# Altium schematic sheet RAM & FLASH.SchDoc
size A
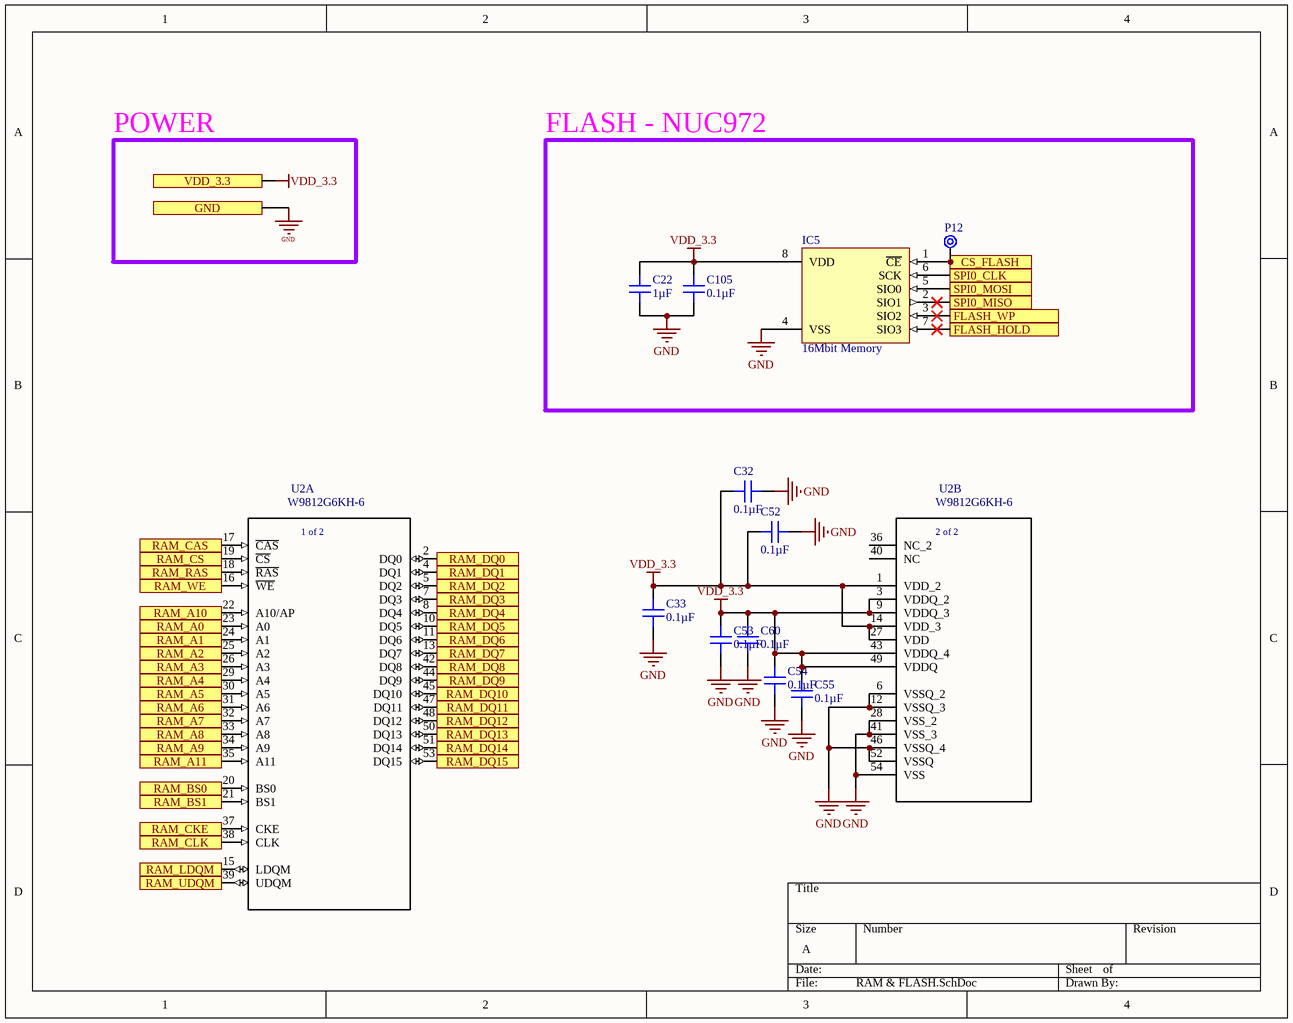
[diagram p0: RAM & FLASH.SchDoc]

## Parts
C22  1µF  [CAP 0603_1608]
C32  0.1µF  [CAP 0603_1608 RF]
C33  0.1µF  [CAP 0603_1608 RF]
C52  0.1µF  [CAP 0603_1608 RF]
C53  0.1µF  [CAP 0603_1608 RF]
C54  0.1µF  [CAP 0603_1608 RF]
C55  0.1µF  [CAP 0603_1608 RF]
C60  0.1µF  [CAP 0603_1608 RF]
C105  0.1µF  [CAP 0603_1608 RF]
IC5  16Mbit Memory  [MICROCHIP SOIC-8 150mil Wide]
P12  1 Pin  [1PINTHRU]  (value not drawn)
U2  W9812G6KH-6  [*WIN_TSOP-54_WIN]  (parts A,B of 2)

## Blocks framed on the sheet
FLASH - NUC972: C22 C105 IC5 P12

## Ports
CS_FLASH, FLASH_HOLD, FLASH_WP, GND, RAM_A0, RAM_A1, RAM_A2, RAM_A3, RAM_A4, RAM_A5, RAM_A6, RAM_A7, RAM_A8, RAM_A9, RAM_A10, RAM_A11, RAM_BS0, RAM_BS1, RAM_CAS, RAM_CKE, RAM_CLK, RAM_CS, RAM_DQ0, RAM_DQ1, RAM_DQ2, RAM_DQ3, RAM_DQ4, RAM_DQ5, RAM_DQ6, RAM_DQ7, RAM_DQ8, RAM_DQ9, RAM_DQ10, RAM_DQ11, RAM_DQ12, RAM_DQ13, RAM_DQ14, RAM_DQ15, RAM_LDQM, RAM_RAS, RAM_UDQM, RAM_WE, SPI0_CLK, SPI0_MISO, SPI0_MOSI, VDD_3.3

## Nets
GND: C22.1 C32.2 C33.2 C52.2 C53.2 C54.2 C55.2 C60.2 C105.2 IC5.4(VSS) U2.6(VSSQ_2) U2.12(VSSQ_3) U2.28(VSS_2) U2.41(VSS_3) U2.46(VSSQ_4) U2.52(VSSQ) U2.54(VSS) ; port GND
VDD_3.3: C22.2 C32.1 C33.1 C52.1 C53.1 C54.1 C55.1 C60.1 C105.1 IC5.8(VDD) U2.1(VDD_2) U2.3(VDDQ_2) U2.9(VDDQ_3) U2.14(VDD_3) U2.27(VDD) U2.43(VDDQ_4) U2.49(VDDQ) ; port VDD_3.3
CS_FLASH: IC5.1(~{CE}) P12.1(PAD) ; port CS_FLASH
FLASH_HOLD: IC5.7(SIO3) ; port FLASH_HOLD
FLASH_WP: IC5.3(SIO2) ; port FLASH_WP
RAM_A0: U2.23(A0) ; port RAM_A0
RAM_A1: U2.24(A1) ; port RAM_A1
RAM_A2: U2.25(A2) ; port RAM_A2
RAM_A3: U2.26(A3) ; port RAM_A3
RAM_A4: U2.29(A4) ; port RAM_A4
RAM_A5: U2.30(A5) ; port RAM_A5
RAM_A6: U2.31(A6) ; port RAM_A6
RAM_A7: U2.32(A7) ; port RAM_A7
RAM_A8: U2.33(A8) ; port RAM_A8
RAM_A9: U2.34(A9) ; port RAM_A9
RAM_A10: U2.22(A10/AP) ; port RAM_A10
RAM_A11: U2.35(A11) ; port RAM_A11
RAM_BS0: U2.20(BS0) ; port RAM_BS0
RAM_BS1: U2.21(BS1) ; port RAM_BS1
RAM_CAS: U2.17(~{CAS}) ; port RAM_CAS
RAM_CKE: U2.37(CKE) ; port RAM_CKE
RAM_CLK: U2.38(CLK) ; port RAM_CLK
RAM_CS: U2.19(~{CS}) ; port RAM_CS
RAM_DQ0: U2.2(DQ0) ; port RAM_DQ0
RAM_DQ1: U2.4(DQ1) ; port RAM_DQ1
RAM_DQ2: U2.5(DQ2) ; port RAM_DQ2
RAM_DQ3: U2.7(DQ3) ; port RAM_DQ3
RAM_DQ4: U2.8(DQ4) ; port RAM_DQ4
RAM_DQ5: U2.10(DQ5) ; port RAM_DQ5
RAM_DQ6: U2.11(DQ6) ; port RAM_DQ6
RAM_DQ7: U2.13(DQ7) ; port RAM_DQ7
RAM_DQ8: U2.42(DQ8) ; port RAM_DQ8
RAM_DQ9: U2.44(DQ9) ; port RAM_DQ9
RAM_DQ10: U2.45(DQ10) ; port RAM_DQ10
RAM_DQ11: U2.47(DQ11) ; port RAM_DQ11
RAM_DQ12: U2.48(DQ12) ; port RAM_DQ12
RAM_DQ13: U2.50(DQ13) ; port RAM_DQ13
RAM_DQ14: U2.51(DQ14) ; port RAM_DQ14
RAM_DQ15: U2.53(DQ15) ; port RAM_DQ15
RAM_LDQM: U2.15(LDQM) ; port RAM_LDQM
RAM_RAS: U2.18(~{RAS}) ; port RAM_RAS
RAM_UDQM: U2.39(UDQM) ; port RAM_UDQM
RAM_WE: U2.16(~{WE}) ; port RAM_WE
SPI0_CLK: IC5.6(SCK) ; port SPI0_CLK
SPI0_MISO: IC5.2(SIO1) ; port SPI0_MISO
SPI0_MOSI: IC5.5(SIO0) ; port SPI0_MOSI

Not connected (* = marked no-connect by the designer): U2 36(NC_2) 40(NC)

## Notes on the sheet
- POWER
- (in symbol W9812G6KH-6, part A) 1 of 2
- (in symbol W9812G6KH-6, part B) 2 of 2

## Library data of the parts
C22 = CAP00007: CAP CER 1UF 10V X7R 0603; Manufacturer: KEMET; Manufacturer P/N: C0603C105K8RACTU; Tolerance: ±10%; Device ID: CAP00007; Mounting Type: Surface Mount; Part Type: Capacitor; VALUE: 1µF; Operating Temperature: -55°C ~ 125°C; Voltage: 10V; Package: 0603 (1608 Metric); Supplier1: Digi-Key; Supplier1 P/N: 399-11133-1-ND; Supplier2: Mouser; Supplier2 P/N: 80-C0603C105K8R; Temperature Coefficient: X7R
C32 C33 C52-C55 C60 C105 = CAP00039: CAP CER 0.1UF 16V X7R 0603; Manufacturer: KEMET; Manufacturer P/N: C0603C104M4RACAUTO; Tolerance: ±20%; Device ID: CAP00039; Mounting Type: Surface Mount; Part Type: Capacitor; VALUE: 0.1µF; Operating Temperature: -55°C ~ 125°C; Voltage: 16V; Package: 0603 (1608 Metric); Supplier1: Digi-Key; Supplier1 P/N: 399-C0603C104M4RACAUTOCT-ND; Supplier2: Mouser; Supplier2 P/N: C0603C104M4RACAUTO; Temperature Coefficient: X7R
IC5 = MEM00002: IC FLASH 4MBIT SPI 40MHZ 8SOIC; Manufacturer: Microchip Technology; Manufacturer P/N: SST25PF040CT-40E/SN; Memory Type: Non-Volatile; Memory Size: 16Mb (512K x 8); Write Cycle Time - Word, Page: 5ms; Voltage - Supply: 2.3V ~ 3.6V; Device ID: MEM00002; Part Type: IC; VALUE: 16Mbit Memory; Operating Temperature: -40°C ~ 125°C (TA); Package: 8-SOIC; Mounting Type: Surface Mount; Memory Format: FLASH; Technology: FLASH; Memory Interface: SPI; Clock Frequency: 40MHz; Supplier1: Mouser; Supplier1 P/N: 579-T26VF016BT-80ESN / SST26VF016BT-80E/SN
P12 = 1 THRU HOLE: Device ID: CON00017; VALUE: 1 Pin Thru; Connector Type: Center Strip Contacts; Style: Board to Board; Number of Positions: 1; Number of Positions Loaded: All; Mounting Type: Surface Mount; Part Type: Header; Package: N/A; Contact Type: Pins; Pitch - Mating: -; Fastening Type: -; Contact Finish - Mating: Tin; Insulation Color: -; Material Flammability Rating: -; Current Rating (Amps): -; Voltage Rating: -; Supplier1: -; Supplier1 P/N: -; Supplier2: -; Supplier2 P/N: -
U2 = W9812G6KH-6: SDRAM Memory IC 128Mb (8M x 16) Parallel 166 MHz 5 ns 54-TSOP II; MF: Winbond Electronics; Package: TSOP-54 Winbond Electronics; Price: None; Check_prices: https://www.snapeda.com/parts/W9812G6KH-6/Winbond+Electronics/view-part/?ref=eda; SnapEDA_Link: https://www.snapeda.com/parts/W9812G6KH-6/Winbond+Electronics/view-part/?ref=snap; MP: W9812G6KH-6; Availability: In Stock; Purchase-URL: https://pricing.snapeda.com/search?q=W9812G6KH-6&ref=eda; Value: *